# EAGLE schematic pycopter_board_v1 (EAGLE 7.7.0)
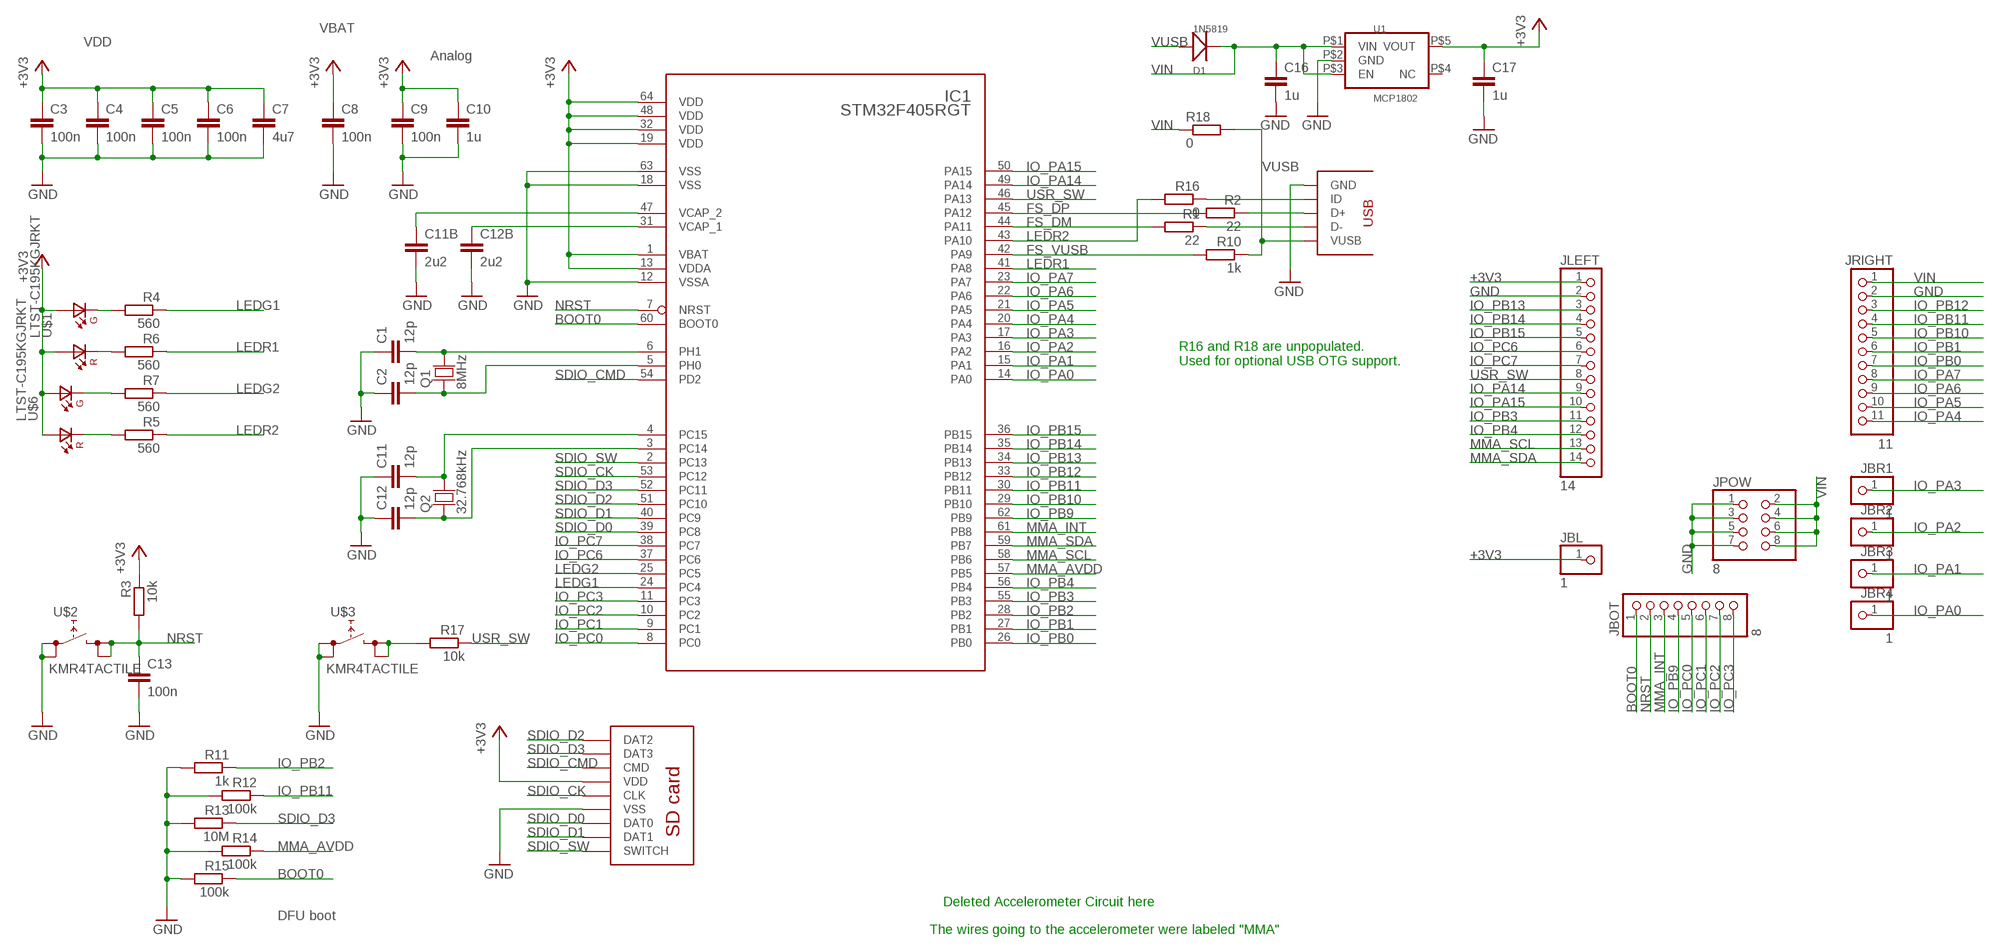
[diagram p0: schematic, sheet 1]

## Parts
C1  12p  C-EUC0603  [C0603]
C2  12p  C-EUC0603  [C0603]
C3  100n  C-EUC0603  [C0603]
C4  100n  C-EUC0603  [C0603]
C5  100n  C-EUC0603  [C0603]
C6  100n  C-EUC0603  [C0603]
C7  4u7  C-EUC0603  [C0603]
C8  100n  C-EUC0603  [C0603]
C9  100n  C-EUC0603  [C0603]
C10  1u  C-EUC0603  [C0603]
C11  12p  C-EUC0603  [C0603]
C11B  2u2  C-EUC0603  [C0603]
C12  12p  C-EUC0603  [C0603]
C12B  2u2  C-EUC0603  [C0603]
C13  100n  C-EUC0603  [C0603]
C16  1u  C-EUC0603  [C0603]
C17  1u  C-EUC0603  [C0603]
D1  1N5819  [SOD-123]
IC1  STM32F405RGT  [LQFP64]
JBL  1  PINHD-1X1  [1X01]
JBOT  8  PINHD-1X8  [1X08]
JBR1  1  PINHD-1X1  [1X01]
JBR2  1  PINHD-1X1  [1X01]
JBR3  1  PINHD-1X1  [1X01]
JBR4  1  PINHD-1X1  [1X01]
JLEFT  14  PINHD-1X14  [1X14]
JPOW  8  PINHD-2X4  [2X04]
JRIGHT  11  PINHD-1X11  [1X11]
Q1  8MHz  TXC-CRYSTAL50X32  [TXC-SMD-50X32]
Q2  32.768kHz  TXC-CRYSTAL32X15  [TXC-SMD-32X15]
R1  22  R-EU_R0603  [R0603]
R2  22  R-EU_R0603  [R0603]
R3  10k  R-EU_R0603  [R0603]
R4  560  R-EU_R0603  [R0603]
R5  560  R-EU_R0603  [R0603]
R6  560  R-EU_R0603  [R0603]
R7  560  R-EU_R0603  [R0603]
R10  1k  R-EU_R0603  [R0603]
R11  1k  R-EU_R0603  [R0603]
R12  100k  R-EU_R0603  [R0603]
R13  10M  R-EU_R0603  [R0603]
R14  100k  R-EU_R0603  [R0603]
R15  100k  R-EU_R0603  [R0603]
R16  0  R-EU_R0603  [R0603]
R17  10k  R-EU_R0603  [R0603]
R18  0  R-EU_R0805  [R0805]
U1  MCP1802  [SOT-23-5]
U$1  LTST-C195KGJRKT  [LTST-BILED-15X16]
U$2  KMR4TACTILE  [KMR4SWITCH]
U$3  KMR4TACTILE  [KMR4SWITCH]
U$4  MOLEX-SD-105027  [MOLEX-SD-105027-PKG]
U$6  LTST-C195KGJRKT  [LTST-BILED-15X16]
U$7  USB-MICRO-AB  [HRS-USB-ZX62D-AB-5P8-PKG]

## Nets
+3V3: C3.1 C4.1 C5.1 C6.1 C7.1 C8.1 C9.1 C10.1 C17.1 IC1.1(VBAT) IC1.13(VDDA) IC1.19(VDD) IC1.32(VDD) IC1.48(VDD) IC1.64(VDD) JBL.1 JLEFT.1 R3.1 U1.P$5(VOUT) U$1.P$1(A1) U$1.P$2(A2) U$4.P$4(VDD) U$6.P$1(A1) U$6.P$2(A2)
BOOT0: IC1.60(BOOT0) JBOT.1 R15.1
FS_DM: IC1.44(PA11) R1.2
FS_DP: IC1.45(PA12) R2.2
FS_VUSB: IC1.42(PA9) R10.2
GND: C1.1 C2.1 C3.2 C4.2 C5.2 C6.2 C7.2 C8.2 C9.2 C10.2 C11.1 C11B.2 C12.1 C12B.2 C13.2 C16.2 C17.2 IC1.12(VSSA) IC1.18(VSS) IC1.63(VSS) JLEFT.2 JPOW.1 JPOW.3 JPOW.5 JPOW.7 JRIGHT.2 R11.2 R12.2 R13.2 R14.2 R15.2 U1.P$2(GND) U$2.P$1 U$2.P$2 U$3.P$1 U$3.P$2 U$4.P$6(VSS) U$7.P$5(GND)
IO_PA0: IC1.14(PA0) JBR4.1
IO_PA1: IC1.15(PA1) JBR3.1
IO_PA2: IC1.16(PA2) JBR2.1
IO_PA3: IC1.17(PA3) JBR1.1
IO_PA4: IC1.20(PA4) JRIGHT.11
IO_PA5: IC1.21(PA5) JRIGHT.10
IO_PA6: IC1.22(PA6) JRIGHT.9
IO_PA7: IC1.23(PA7) JRIGHT.8
IO_PA14: IC1.49(PA14) JLEFT.9
IO_PA15: IC1.50(PA15) JLEFT.10
IO_PB0: IC1.26(PB0) JRIGHT.7
IO_PB1: IC1.27(PB1) JRIGHT.6
IO_PB2: IC1.28(PB2) R11.1
IO_PB3: IC1.55(PB3) JLEFT.11
IO_PB4: IC1.56(PB4) JLEFT.12
IO_PB9: IC1.62(PB9) JBOT.4
IO_PB10: IC1.29(PB10) JRIGHT.5
IO_PB11: IC1.30(PB11) JRIGHT.4 R12.1
IO_PB12: IC1.33(PB12) JRIGHT.3
IO_PB13: IC1.34(PB13) JLEFT.3
IO_PB14: IC1.35(PB14) JLEFT.4
IO_PB15: IC1.36(PB15) JLEFT.5
IO_PC0: IC1.8(PC0) JBOT.5
IO_PC1: IC1.9(PC1) JBOT.6
IO_PC2: IC1.10(PC2) JBOT.7
IO_PC3: IC1.11(PC3) JBOT.8
IO_PC6: IC1.37(PC6) JLEFT.6
IO_PC7: IC1.38(PC7) JLEFT.7
LEDG1: IC1.24(PC4) R4.1
LEDG2: IC1.25(PC5) R7.1
LEDR1: IC1.41(PA8) R6.1
LEDR2: IC1.43(PA10) R5.1 R16.2
MMA_AVDD: IC1.57(PB5) R14.1
MMA_INT: IC1.61(PB8) JBOT.3
MMA_SCL: IC1.58(PB6) JLEFT.13
MMA_SDA: IC1.59(PB7) JLEFT.14
N$1: C11B.1 IC1.47(VCAP_2)
N$2: C12B.1 IC1.31(VCAP_1)
N$3: R2.1 U$7.P$3(D+)
N$4: R1.1 U$7.P$2(D-)
N$5: C12.2 IC1.3(PC14) Q2.P$1
N$6: C11.2 IC1.4(PC15) Q2.P$2
N$7: R16.1 U$7.P$4(ID)
N$9: C1.2 IC1.6(PH1) Q1.P$2
N$10: C2.2 IC1.5(PH0) Q1.P$1
N$11: R4.2 U$1.P$3(K1)
N$12: R5.2 U$6.P$4(K2)
N$13: R6.2 U$1.P$4(K2)
N$14: R7.2 U$6.P$3(K1)
N$15: R17.2 U$3.P$3 U$3.P$4
NRST: C13.1 IC1.7(NRST) JBOT.2 R3.2 U$2.P$3 U$2.P$4
SDIO_CK: IC1.53(PC12) U$4.P$5(CLK)
SDIO_CMD: IC1.54(PD2) U$4.P$3(CMD)
SDIO_D0: IC1.39(PC8) U$4.P$7(DAT0)
SDIO_D1: IC1.40(PC9) U$4.P$8(DAT1)
SDIO_D2: IC1.51(PC10) U$4.P$1(DAT2)
SDIO_D3: IC1.52(PC11) R13.1 U$4.P$2(DAT3)
SDIO_SW: IC1.2(PC13) U$4.G$1(SWITCH)
USR_SW: IC1.46(PA13) JLEFT.8 R17.1
VIN: C16.1 D1.K JPOW.2 JPOW.4 JPOW.6 JPOW.8 JRIGHT.1 R18.1 U1.P$1(VIN) U1.P$3(EN)
VUSB: D1.A R10.1 R18.2 U$7.P$1(VUSB)
Unconnected: U1.P$4(NC)

## Notes on the sheet
- VBAT
- VDD
- Analog
- R16 and R18 are unpopulated.
  Used for optional USB OTG support.
- Deleted Accelerometer Circuit here
- DFU boot
- The wires going to the accelerometer were labeled "MMA"

## Library data of the parts
C1-C11 C11B C12 C12B C13 C16 C17 = rcl:C-EU: CAPACITOR, European symbol
D1 = pyboard:1N5819
IC1 = pyboard:STM32F405R*T: STM32F405R*T ARM Cortex-M4 32b MCU+FPU, 210DMIPS, up to 1MB Flash/192+4KB RAM, USB OTG HS/FS, 17 TIMs, 3 ADCs, 15 comm.
JBL JBR1-JBR4 = pinhead:PINHD-1X1: PIN HEADER
JBOT = pinhead:PINHD-1X8: PIN HEADER
JLEFT = pinhead:PINHD-1X14: PIN HEADER
JPOW = pinhead:PINHD-2X4: PIN HEADER
JRIGHT = pinhead:PINHD-1X11: PIN HEADER
Q1 Q2 = pyboard:TXC-CRYSTAL
R1-R7 R10-R18 = rcl:R-EU_: RESISTOR, European symbol
U1 = pyboard:MCP1802
U$1 U$6 = pyboard:LTST-C195KGJRKT
U$2 U$3 = pyboard:KMR4TACTILE
U$4 = pyboard:MOLEX-SD-105027
U$7 = pyboard:USB-MICRO-AB

## Net classes
0 default: width 0.15 mm, drill 0.25 mm, clearance 0.15 mm